# Altium schematic sheet 14_Temp.SchDoc: Power
size A3; Organization: Lime Microsystems; Address1: Surrey Tech Centre; Address2: Guildford GU2 7YG; Address3: Surrey; Address4: United Kingdom; Revision: v1.2; SheetNumber: 13; SheetTotal: 13
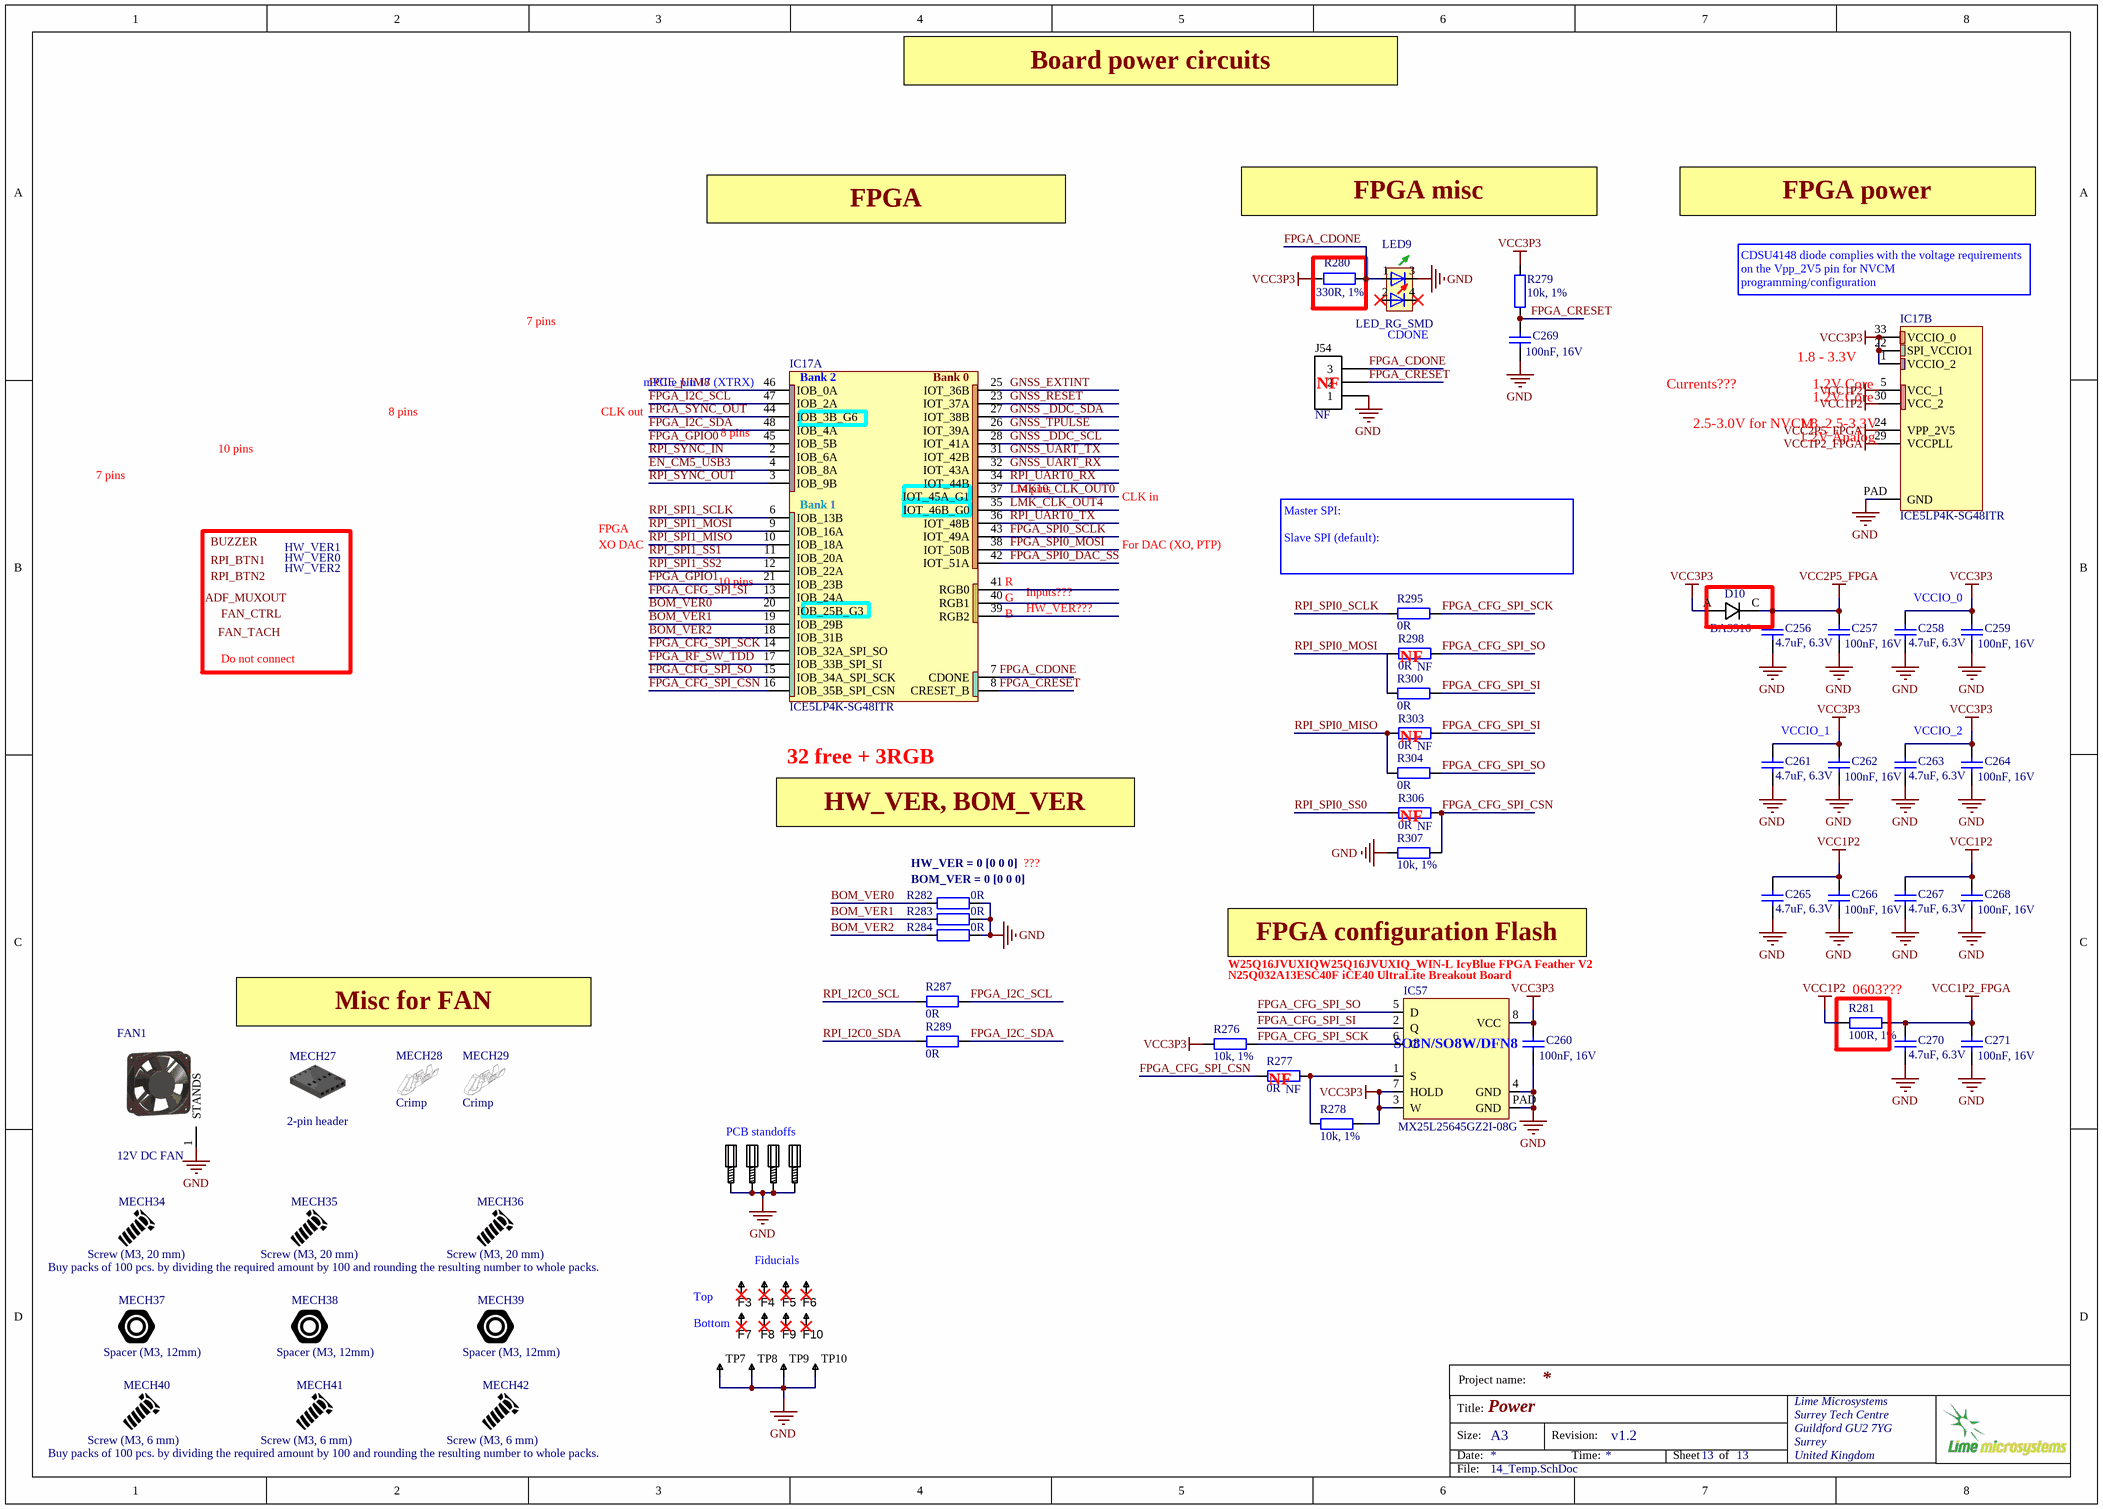
[diagram p0: 14_Temp.SchDoc]

## Parts
C256  4.7uF, 6.3V  [CAP0402]
C257  100nF, 16V  [CAP0402]
C258  4.7uF, 6.3V  [CAP0402]
C259  100nF, 16V  [CAP0402]
C260  100nF, 16V  [CAP0402]
C261  4.7uF, 6.3V  [CAP0402]
C262  100nF, 16V  [CAP0402]
C263  4.7uF, 6.3V  [CAP0402]
C264  100nF, 16V  [CAP0402]
C265  4.7uF, 6.3V  [CAP0402]
C266  100nF, 16V  [CAP0402]
C267  4.7uF, 6.3V  [CAP0402]
C268  100nF, 16V  [CAP0402]
C269  100nF, 16V  [CAP0402]
C270  4.7uF, 6.3V  [CAP0402]
C271  100nF, 16V  [CAP0402]
D10  BAS316  [BAS316_DIODE_SOD323]
F3  Fiducial  [Fiducial]  (value not drawn)
F4  Fiducial  [Fiducial]  (value not drawn)
F5  Fiducial  [Fiducial]  (value not drawn)
F6  Fiducial  [Fiducial]  (value not drawn)
F7  Fiducial  [Fiducial]  (value not drawn)
F8  Fiducial  [Fiducial]  (value not drawn)
F9  Fiducial  [Fiducial]  (value not drawn)
F10  Fiducial  [Fiducial]  (value not drawn)
FAN1  12V DC FAN  [FAN_80mm_V1]
IC17  ICE5LP4K-SG48ITR  [ICE5LP4K-SG48ITR_Lattice_FPGA_QFN48]  (parts A,B of 2)
IC57  MX25L25645GZ2I-08G  [S25FL164K_WSON8_DFN6]
J54  Assembly Info: NF  [HDR_1x3]  (hidden comment: Header 3x1 pin)
LED9  LED_RG_SMD  [LED-2x0603]
MECH27  2-pin header  (mechanical)
MECH28  Crimp  (mechanical)
MECH29  Crimp  (mechanical)
MECH30  # pcs.  [PCB_standoff]  (value not drawn)
MECH31  # pcs.  [PCB_standoff]  (value not drawn)
MECH32  # pcs.  [PCB_standoff]  (value not drawn)
MECH33  # pcs.  [PCB_standoff]  (value not drawn)
MECH34  Screw (M3, 20 mm)  (mechanical)
MECH35  Screw (M3, 20 mm)  Assembly Info: Buy packs of 100 pcs. by dividing the required amount by 100 and rounding the resulting number to whole packs.  (mechanical)
MECH36  Screw (M3, 20 mm)  (mechanical)
MECH37  Spacer (M3, 12mm)  (mechanical)
MECH38  Spacer (M3, 12mm)  (mechanical)
MECH39  Spacer (M3, 12mm)  (mechanical)
MECH40  Screw (M3, 6 mm)  (mechanical)
MECH41  Screw (M3, 6 mm)  Assembly Info: Buy packs of 100 pcs. by dividing the required amount by 100 and rounding the resulting number to whole packs.  (mechanical)
MECH42  Screw (M3, 6 mm)  (mechanical)
R276  10k, 1%  [RES0402]
R277  0R  Assembly Info: NF  [RES0402]
R278  10k, 1%  [RES0402]
R279  10k, 1%  [RES0402]
R280  330R, 1%  [RES0402]
R281  100R, 1%  [RES0603]
R282  0R  [RES0402]
R283  0R  [RES0402]
R284  0R  [RES0402]
R287  0R  [RES0402]
R289  0R  [RES0402]
R295  0R  [RES0402]
R298  0R  Assembly Info: NF  [RES0402]
R300  0R  [RES0402]
R303  0R  Assembly Info: NF  [RES0402]
R304  0R  [RES0402]
R306  0R  Assembly Info: NF  [RES0402]
R307  10k, 1%  [RES0402]
TP7  TESTPOINT_THT_MINI  [TP-SMD-LOW_PROFILE]  (value not drawn)
TP8  TESTPOINT_THT_MINI  [TP-SMD-LOW_PROFILE]  (value not drawn)
TP9  TESTPOINT_THT_MINI  [TP-SMD-LOW_PROFILE]  (value not drawn)
TP10  TESTPOINT_THT_MINI  [TP-SMD-LOW_PROFILE]  (value not drawn)

## Nets
GND: C256.1 C257.2 C258.1 C259.2 C260.2 C261.1 C262.2 C263.1 C264.2 C265.1 C266.2 C267.1 C268.2 C269.2 C270.1 C271.2 FAN1.1(STANDS) IC17.PAD(GND) IC57.4(GND) IC57.PAD(GND) J54.1 LED9.3 MECH30.MH1 MECH31.MH1 MECH32.MH1 MECH33.MH1 R282.2 R283.2 R284.2 R307.1 TP7.1 TP8.1 TP9.1 TP10.1
VCC1P2: C265.2 C266.1 C267.2 C268.1 IC17.5(VCC_1) IC17.30(VCC_2) R281.2
VCC1P2_FPGA: C270.2 C271.1 IC17.29(VCCPLL) R281.1
VCC2P5_FPGA: C256.2 C257.1 D10.C IC17.24(VPP_2V5)
VCC3P3: C258.2 C259.1 C260.1 C261.2 C262.1 C263.2 C264.1 D10.A IC17.1(VCCIO_2) IC17.22(SPI_VCCIO1) IC17.33(VCCIO_0) IC57.3(W) IC57.7(HOLD) IC57.8(VCC) R276.2 R278.2 R279.1 R280.2
BOM_VER0: IC17.20(IOB_25B_G3) R282.1
BOM_VER1: IC17.19(IOB_29B) R283.1
BOM_VER2: IC17.18(IOB_31B) R284.1
EN_CM5_USB3: IC17.4(IOB_8A)
FPGA_CDONE: IC17.7(CDONE) J54.3 LED9.1 R280.1
FPGA_CFG_SPI_CSN: IC17.16(IOB_35B_SPI_CSN) R277.2 R306.1 R307.2
FPGA_CFG_SPI_SCK: IC17.14(IOB_32A_SPI_SO) IC57.6(C) R276.1 R295.2
FPGA_CFG_SPI_SI: IC17.13(IOB_24A) IC57.2(Q) R300.2 R303.1
FPGA_CFG_SPI_SO: IC17.15(IOB_34A_SPI_SCK) IC57.5(D) R298.1 R304.2
FPGA_CRESET: C269.1 IC17.8(CRESET_B) J54.2 R279.2
FPGA_GPIO0: IC17.45(IOB_5B)
FPGA_GPIO1: IC17.21(IOB_23B)
FPGA_I2C_SCL: IC17.47(IOB_2A) R287.2
FPGA_I2C_SDA: IC17.48(IOB_4A) R289.2
FPGA_RF_SW_TDD: IC17.17(IOB_33B_SPI_SI)
FPGA_SPI0_DAC_SS: IC17.42(IOT_51A)
FPGA_SPI0_MOSI: IC17.38(IOT_50B)
FPGA_SPI0_SCLK: IC17.43(IOT_49A)
FPGA_SYNC_OUT: IC17.44(IOB_3B_G6)
GNSS _DDC_SCL: IC17.28(IOT_41A)
GNSS _DDC_SDA: IC17.27(IOT_38B)
GNSS_EXTINT: IC17.25(IOT_36B)
GNSS_RESET: IC17.23(IOT_37A)
GNSS_TPULSE: IC17.26(IOT_39A)
GNSS_UART_RX: IC17.32(IOT_43A)
GNSS_UART_TX: IC17.31(IOT_42B)
LMK10_CLK_OUT0: IC17.37(IOT_45A_G1)
LMK_CLK_OUT4: IC17.35(IOT_46B_G0)
PCIE_UIM8: IC17.46(IOB_0A)
RPI_I2C0_SCL: R287.1
RPI_I2C0_SDA: R289.1
RPI_SPI0_MISO: R303.2 R304.1
RPI_SPI0_MOSI: R298.2 R300.1
RPI_SPI0_SCLK: R295.1
RPI_SPI0_SS0: R306.2
RPI_SPI1_MISO: IC17.10(IOB_18A)
RPI_SPI1_MOSI: IC17.9(IOB_16A)
RPI_SPI1_SCLK: IC17.6(IOB_13B)
RPI_SPI1_SS1: IC17.11(IOB_20A)
RPI_SPI1_SS2: IC17.12(IOB_22A)
RPI_SYNC_IN: IC17.2(IOB_6A)
RPI_SYNC_OUT: IC17.3(IOB_9B)
RPI_UART0_RX: IC17.34(IOT_44B)
RPI_UART0_TX: IC17.36(IOT_48B)
NetIC57_1: IC57.1(S) R277.1 R278.1

Not connected (* = marked no-connect by the designer): F3 1*; F4 1*; F5 1*; F6 1*; F7 1*; F8 1*; F9 1*; F10 1*; IC17 39(RGB2) 40(RGB1) 41(RGB0); LED9 2* 4*

## Notes on the sheet
- Board power circuits
- FPGA
- FPGA misc
- FPGA power
- (near IC17) CDSU4148 diode complies with the voltage requirements on the Vpp_2V5 pin for NVCM programming/configuration
- 7 pins
- (near LED9) CDONE
- (near IC17) 1.8 - 3.3V
- 10 pins
- 8 pins
- CLK out
- mPCIe pin 17 (XTRX)
- (near IC17) 8 pins
- (near J54) NF
- Currents???
- 2.5-3.0V for NVCM
- (near IC17) 1.2V Analog
- (near IC17) 1.8, 2.5-3,3V
- (near IC17) 1.2V Core
- (near IC17) 14 pins
- CLK in
- HW_VER0
- HW_VER1
- HW_VER2
- XO DAC
- (near IC17) 10 pins
- (near IC17) R
- For DAC (XO, PTP)
- (near R295) Master SPI:
  Slave SPI (default):
- (near IC17) G
- (near IC17) B
- (near IC17) Inputs???
- (near IC17) HW_VER???
- VCCIO_0
- Do not connect
- (near R298) NF
- 32 free + 3RGB
- (near R303) NF
- VCCIO_1
- VCCIO_2
- HW_VER, BOM_VER
- (near R306) NF
- (near R282) BOM_VER = 0 [0 0 0]
- HW_VER = 0 [0 0 0]
- ???
- FPGA configuration Flash
- (near IC57) W25Q16JVUXIQW25Q16JVUXIQ_WIN-L IcyBlue FPGA Feather V2
- (near IC57) N25Q032A13ESC40F iCE40 UltraLite Breakout Board
- Misc for FAN
- 0603???
- (near R277) NF
- PCB standoffs
- Top
- (near F7) Bottom
- Fiducials
- Labels drawn without touching a wire or pin: ADF_MUXOUT, BUZZER, FAN_CTRL, FAN_TACH, RPI_BTN1, RPI_BTN2
- Project name:
- Title:
- Size:
- Date:
- A3
- Revision:
- Time:
- Sheet
- of
- File:
- (in symbol ICE5LP4K-SG48ITR_Lattice_FPGA, part A) Bank 2; Bank 0; Bank 1
- (in symbol M25P40_with_pad) SO8N/SO8W/DFN8

## Library data of the parts
C256 C258 C261 C263 C265 C267 C270 = Cap_0402: Manufacturer: Murata Electronics North America; Manufacturer Part Number: GRM155R60J475ME87D; Part Description: 4.7µF ±20% 6.3V X5R Ceramic Capacitor -55°C ~ 85°C Surface Mount, MLCC 0402 (1005 Metric) 0.039" L x 0.020" W (1.00mm x 0.50mm); Tolerance: ±20%; Capacitance: 4.7µF; Temperature Coefficient: X5R; Lead Style: -; Ratings: -; Height - Seated (Max): -; Thickness (Max): 0.022" (0.55mm); Voltage - Rated: 6.3V; Packaging: Cut Tape (CT); Lead Spacing: -; Category: Capacitors; Supplier Part Number 1: 490-5408-1-ND; Applications: General Purpose; Operating Temperature: -55°C ~ 85°C; Mounting Type: Surface Mount, MLCC; Features: Derating Recommended; RoHS: RoHS Compliant; Supplier 1: Digi-Key; Package / Case: 0402 (1005 Metric); Size / Dimension: 0.039" L x 0.020" W (1.00mm x 0.50mm); Value: 4.7uF, 6.3V; Manufacturer Part Number 1: GRM155R60J475ME87D
C257 C259 C260 C262 C264 C266 C268 C269 C271 = Cap_0603: Manufacturer Part Number 1: GRM155R71C104KA88D; Part Description: 0.10µF ±10% 16V Ceramic Capacitor X7R 0402 (1005 Metric); Brand: Murata Electronics; Tolerance: 10 %; Type: General Purpose MLCC; Capacitance: 0.1 uF; Temperature Coefficient / Code: +/- 15 %; Case Height: 0.5 mm; Case Length: 1 mm; Dielectric: X7R; Supplier 1: Mouser; Supplier Part Number 1: 81-GRM155R71C104KA88; Case Code - in: 0402; Manufacturer: Murata Electronics; Category: Multilayer Ceramic Capacitors MLCC - SMD/SMT; Voltage Rating DC: 16 V; Value: 100nF, 16V; Manufacturer Part Number: GRM155R71C104KA88D; Case Code - mm: 1005; Case Width: 0.5 mm; Maximum Operating Temperature: + 125 C; Minimum Operating Temperature: - 55 C; Minimum Order Quantity: 1; Operating Temperature Range: - 55 C to + 125 C; Package / Case: 0402 (1005 metric); Packaging: Reel; Product: General Type MLCCs; Product Category: Low & Medium Capacitance SMD Ceramic Chip Capacitors; Reeling: True; RoHS - Mouser: Y; RoHS: RoHS Compliant; Series: GRM; Standard Pack Qty: 10000; Termination Style: SMD/SMT
D10 = MURA120T3G_diode: Part Description: DIODE GEN PURP 100V 250MA SOD323; Manufacturer: Nexperia; Manufacturer Part Number 1: BAS316,115; ComponentLink1URL: http://www.mouser.com/ds/2/427/mmsz5225-102133.pdf; ComponentLink1Description: http://www.mouser.com/ds/2/427/mmsz5225-102133.pdf; ComponentLink2URL: http://www.onsemi.com/pub/Collateral/MMSD4148T1-D.PDF; ComponentLink2Description: http://www.onsemi.com/pub/Collateral/MMSD4148T1-D.PDF; ComponentLink3URL: http://www.farnell.com/datasheets/1707241.pdf; ComponentLink3Description: http://www.farnell.com/datasheets/1707241.pdf; ComponentLink4URL: https://www.verical.com/server-webapp/html/getDatasheet?partID=78734; ComponentLink4Description: https://www.verical.com/server-webapp/html/getDatasheet?partID=78734; ComponentLink5URL: http://www.onsemi.com/pub/Collateral/MURA115T3-D.PDF; ComponentLink5Description: http://www.onsemi.com/pub/Collateral/MURA115T3-D.PDF; ComponentLink6URL: http://www.jameco.com/Jameco/Products/ProdDS/1100812.pdf; ComponentLink6Description: http://www.jameco.com/Jameco/Products/ProdDS/1100812.pdf; ComponentLink7URL: http://uk.rs-online.com/webdocs/1221/0900766b812212fb.pdf; ComponentLink7Description: http://uk.rs-online.com/webdocs/1221/0900766b812212fb.pdf; ComponentLink8URL: http://www.farnell.com/datasheets/1750742.pdf; ComponentLink8Description: http://www.farnell.com/datasheets/1750742.pdf; Supplier 1: Digi-Key; Supplier Part Number 1: 1727-4309-1-ND; Stock 1: 163548; Pricing 1: 1=0,16000, 10=0,14200, 100=0,07710, 500=0,04744, 1000=0,03234 (USD); RoHS: Yes; RoHS Compliant: Yes; ComponentLink9URL: http://www.farnell.com/datasheets/1856332.pdf?src-supplier=Farnell; ComponentLink9Description: http://www.farnell.com/datasheets/1856332.pdf?src-supplier=Farnell; ComponentLink10URL: https://assets.nexperia.com/documents/data-sheet/BAS16_SER.pdf?src-supplier=Digi-Key; ComponentLink10Description: https://assets.nexperia.com/documents/data-sheet/BAS16_SER.pdf?src-supplier=Digi-Key; ComponentLink11URL: http://www.farnell.com/datasheets/1856332.pdf?src-supplier=Newark; ComponentLink11Description: http://www.farnell.com/datasheets/1856332.pdf?src-supplier=Newark
FAN1 = 12V_DC_FAN: Part Description: Fan Tubeaxial 12VDC Square - 80mm L x 80mm H Vapo-Bearing™ 37.0 CFM (1.04m³/min) 2 Wire Leads; Manufacturer: Sunon; Manufacturer Part Number 1: ME80151V1-000U-A99; Airflow: 37CFM; Noise: 34.7dBA; Max Power Dissipation: 1.96W; RPM: 3000RPM; Bearing Type: Vapo-Bearing; Current Rating: 163mA; Approvals: UL,CE,TUV; Supplier 1: Digi-Key; Supplier Part Number 1: 259-1649-ND; Stock 1: 1611; Pricing 1: 1=6,90000, 10=6,66700, 25=6,47400, 50=6,08860, 100=5,47200, 250=5,39488, 500=5,04808 (USD); RoHS: Yes; Case/Package: Axial; Housing Material: Thermoplastic; Weight: 0.15lb; Min Operating Temperature: 14°C; Max Operating Temperature: 158°C; Termination: 2 Wire Leads; Package Quantity: 30; Width: 15mm; Flammability Rating: UL94 V-0; ComponentLink1URL: https://datasheet.ciiva.com/18514/me8015-u-18514537.pdf?src-supplier=Digi-Key; ComponentLink1Description: https://datasheet.ciiva.com/18514/me8015-u-18514537.pdf?src-supplier=Digi-Key
IC17 = ICE5LP4K-SG48ITR_Lattice_FPGA: Part Description: iCE40 Ultra™ Field Programmable Gate Array (FPGA) IC 39 81920 3520 48-VFQFN Exposed Pad; Manufacturer: Lattice Semiconductor; Supplier 1: Digikey; Supplier Part Number 1: 220-2234-1-ND; Manufacturer Part Number 1: ICE5LP4K-SG48ITR; Stock 1: 1298; Pricing 1: 1=8,8, 25=7,65, 100=7,41 (USD); RoHS: Yes; ComponentLink1URL: https://datasheet.octopart.com/ICE5LP4K-SG48ITR-Lattice-Semiconductor-datasheet-46750633.pdf?src-supplier=Future+Electronics; ComponentLink1Description: https://datasheet.octopart.com/ICE5LP4K-SG48ITR-Lattice-Semiconductor-datasheet-46750633.pdf?src-supplier=Future+Electronics; ComponentLink2URL: http://www.latticesemi.com/~/media/LatticeSemi/Documents/DataSheets/iCE/iCE40UltraFamilyDataSheet.pdf?src-supplier=Digikey; ComponentLink2Description: http://www.latticesemi.com/~/media/LatticeSemi/Documents/DataSheets/iCE/iCE40UltraFamilyDataSheet.pdf?src-supplier=Digikey; ComponentLink3URL: https://datasheet.octopart.com/ICE5LP4K-SG48ITR-Lattice-Semiconductor-datasheet-94675077.pdf?src-supplier=SHENGYU+ELECTRONICS; ComponentLink3Description: https://datasheet.octopart.com/ICE5LP4K-SG48ITR-Lattice-Semiconductor-datasheet-94675077.pdf?src-supplier=SHENGYU+ELECTRONICS
IC57 = M25P40_with_pad: Part Description: FLASH - NOR Memory IC 256Mbit SPI 120 MHz 8-WSON (8x6); Manufacturer: Macronix; Memory Type: Non-Volatile,FLASH; Memory Size: 256Mb; Frequency: 120MHz; ComponentLink1URL: http://www.winbond.com/resource-files/w25q128jv%20revf%2003272018%20plus.pdf?src-supplier=Digi-Key; ComponentLink1Description: http://www.winbond.com/resource-files/w25q128jv%20revf%2003272018%20plus.pdf?src-supplier=Digi-Key; ComponentLink2URL: http://www.macronix.com/Lists/Datasheet/Attachments/7549/MX25L25645G,%203V,%20256Mb,%20v1.7.pdf?src-supplier=Digi-Key; ComponentLink2Description: http://www.macronix.com/Lists/Datasheet/Attachments/7549/MX25L25645G,%203V,%20256Mb,%20v1.7.pdf?src-supplier=Digi-Key; ComponentLink3URL: http://ckassoc.com/oldsite/pdf/Macronix_Product_Line_Card_July_2017_General%20_070617.pdf?src-supplier=Digi-Key; ComponentLink3Description: http://ckassoc.com/oldsite/pdf/Macronix_Product_Line_Card_July_2017_General%20_070617.pdf?src-supplier=Digi-Key; Value: MX25L25645GZ2I-08G; Supplier 1: Digi-Key; Supplier Part Number 1: 1092-1237-ND; Manufacturer Part Number 1: MX25L25645GZ2I-08G; Stock 1: 23084; Pricing 1: 1=4,06000, 10=3,68400, 25=3,60360, 40=3,58400, 80=3,21363, 230=3,20191, 480=3,08490, 960=2,93280 (USD); RoHS: Yes; Mount: Surface Mount; Case/Package: SOIC; Min Operating Temperature: -40°C; Max Operating Temperature: 85°C; RoHS Compliant: Yes; ComponentLink4URL: http://www.macronix.com/Lists/Datasheet/Attachments/7444/MX25L25673G,%203V,%20256Mb,%20v1.4.pdf?src-supplier=Digi-Key; ComponentLink4Description: http://www.macronix.com/Lists/Datasheet/Attachments/7444/MX25L25673G,%203V,%20256Mb,%20v1.4.pdf?src-supplier=Digi-Key
J54 = Header3P: Header, 3-pin; Manufacturer 1: Wurth Electronics; Manufacturer Part Number: 61300311121; Part Description: Connector Header Through Hole 3 position 0.100" (2.54mm); Number of Positions: 3; Gender: Male; Connector Type: Male Pin; Pitch: 0.1inch; Supplier 1: Digi-Key; Supplier Part Number 1: 732-5316-ND; Stock 1: 95926; Pricing 1: 1=0,13000, 10=0,11300, 25=0,09400, 50=0,07900, 100=0,07100, 1000=0,06600 (USD); RoHS: Yes; Mount: Through Hole; Contact Plating: Gold; Contact Material: Copper; Color: Black; Number of Rows: 1; Packaging: Bulk; Termination: Solder; Number of Contacts: 3; Contact Mating Length: 0.236inch; REACH SVHC: Unknown; Lead Free: Lead Free; RoHS Compliant: Yes; ComponentLink1URL: http://www.farnell.com/cad/1737268.pdf?src-supplier=Element14; ComponentLink1Description: http://www.farnell.com/cad/1737268.pdf?src-supplier=Element14; ComponentLink2URL: https://katalog.we-online.de/em/datasheet/6130xx11121.pdf?src-supplier=Digi-Key; ComponentLink2Description: https://katalog.we-online.de/em/datasheet/6130xx11121.pdf?src-supplier=Digi-Key; Manufacturer: Wurth Electronics; Manufacturer Part Number 1: 61300311121
LED9 = LED_green_red_SMD: Manufacturer Part Number 1: HSMF-C165; Manufacturer: Avago Technologies US Inc.; Part Description: LED GREEN/RED DIFFUSED 0603 SMD; Millicandela Rating: 15mcd Green, 10mcd Red; Lens Transparency: Diffused; Lens Color: White; Lens Style/Size: Rectangle with Flat Top, 1.60mm x 0.80mm; Wavelength - Peak: 570nm Green, 636nm Red; Wavelength - Dominant: 572nm Green, 621nm Red; Viewing Angle: 120°; Voltage - Forward (Vf) (Typ): 2.2V Green, 1.95V Red; Current - Test: 20mA; Color: Green, Red; Supplier 1: Digi-Key; Height (Max): 0.50mm; Packaging: Cut Tape (CT); Category: Optoelectronics; Mounting Type: Surface Mount; Package / Case: 0603 (1608 Metric); Size / Dimension: 1.60mm L x 0.80mm W; Supplier Device Package: *; RoHS: RoHS Compliant; Supplier Part Number 1: 516-1419-1-ND
MECH27 = Universal_crimped_header: Part Description: 2 Rectangular Connectors - Housings Receptacle White 0.100" (2.54mm); Manufacturer: Molex; Gender: Female; Voltage Rating: 250V; Number of Contacts: 2; Connector Type: Receptacle; Max Current Rating: 4A; Pitch: 2.54mm; Glow Wire Compliant: Non-compliant; Approvals: UL,CSA; Supplier 1: Newark; Supplier Part Number 1: 47T5763; Manufacturer Part Number 1: 22-01-2027; Stock 1: 50789; Pricing 1: 1=0,12200, 10=0,09500, 25=0,08600, 50=0,07700, 100=0,06700, 250=0,06400 (USD); RoHS: Yes; Mount: Free Hanging,Cable; Contact Material: Bronze,Brass; Color: White; Housing Color: White; Housing Material: Nylon; Min Operating Temperature: 0°C; Max Operating Temperature: 75°C; Number of Rows: 1; Package Quantity: 5000; Packaging: Bag; Termination: Crimp; Number of Circuits: 2; Number of Positions: 2; Orientation: Straight; Series: KK® 2695; Contact Type: Non-Gendered; Contact Gender: Female; Fastening Type: Ramp; Length: 5.64mm; Width: 4.82mm; Height: 4.82mm; Depth: 12.7mm; Lead Pitch: 2.54mm; Radiation Hardening: No; Halogen Free: Low Halogen; Flammability Rating: UL94 V-0; RoHS Compliant: Yes; Lead Free: Lead Free
MECH28 MECH29 = Universal_crimp: Part Description: Non-Gendered Contact Tin 22-30 AWG Crimp; Manufacturer: Molex; Body Plating: Tin; Current Rating: 4A; Voltage Rating: 250V; Gender: Female; Connector Type: PCB; Number of Contacts: 1; Contact Resistance: 20mR; Max Current Rating: 2.5A; Resistance: 0.02R; Insulation Resistance: 500GR; Shielding: Unshielded; Wire Gauge (Max): 22AWG; Wire Gauge (Min): 30AWG; Wire/Cable Diameter: 1.57mm; Approvals: UL,CSA; Supplier 1: Mouser; Supplier Part Number 1: 538-08-50-0032; Manufacturer Part Number 1: 08-50-0032; Stock 1: 153072; Pricing 1: 1=0,12000, 10=0,08100, 50=0,08000, 100=0,08000, 1000=0,06400, 10000=0,06400 (USD); RoHS: Yes; Mount: Cable; Contact Material: Brass; Housing Material: Nylon; Terminal Material: Brass; Contact Plating: Tin,Brass; Min Operating Temperature: 0°C; Max Operating Temperature: 75°C; Contact Gender: Female; Packaging: Bulk; Termination: Crimp; Orientation: Straight; Series: KK® 4809; Contact Type: Signal; Voltage Rating (AC): 250V; Package Quantity: 80000; Max Voltage Rating (AC): 250V; Length: 10.4mm; Depth: 2.1mm; Wire/Cable Gauge: 30AWG; Radiation Hardening: No; RoHS Compliant: Yes; Reach SVHC Compliant: Yes; ComponentLink1URL: https://datasheet.ciiva.com/15217/getdatasheetpartid-168593-15217171.pdf?src-supplier=Verical; ComponentLink1Description: https://datasheet.ciiva.com/15217/getdatasheetpartid-168593-15217171.pdf?src-supplier=Verical; ComponentLink2URL: https://datasheet.ciiva.com/19462/736464-19462410.pdf?src-supplier=Jameco; ComponentLink2Description: https://datasheet.ciiva.com/19462/736464-19462410.pdf?src-supplier=Jameco; ComponentLink3URL: https://datasheet.ciiva.com/11723/0900766b80027326-11723308.pdf?src-supplier=Rs; ComponentLink3Description: https://datasheet.ciiva.com/11723/0900766b80027326-11723308.pdf?src-supplier=Rs
MECH30-MECH33 = STANDOFF_M-F_THREADED_M3x8x10mm_HEX_5mm dia: STANDOFF M/F MET 5MM HEX 10MM L; Manufacturer: FIX&FASTEN; Manufacturer Part Number 1: FIX-MAE-5TV; Part Description: PCB distance; polyamide; L:5mm; Colour: natural; Øcutout:3mm; Unit: pcs; SuppliedAmount: 1000; MinAmount: 10; Type of spacer: PCB distance; Panel cutout diameter: 3mm; Spanner size: 5.5mm; Internal thread: M3; Thread pitch: 0,5; Supplier 1: TME; Supplier Part Number 1: FIX-MAE-5TV; Category: Plastic Pegs; Weight: 0.145; Multiples: 10; Material: polyamide; Spacer length: 5mm; Price Type: NET
MECH34 MECH36 = Universal_mech_screw: Part Description: Machine Screw, M3, 20 mm, Steel, Bright Zinc, Flat / Countersunk Head Pozidriv, Pack of 100; Manufacturer: TR Fastenings; Manufacturer Part Number 1: M3 20 KRSTMC Z100; Assembly Info: Buy packs of 100 pcs. by dividing the required amount by 100 and rounding the resulting number to whole packs.; Supplier 1: Farnell; Supplier Part Number 1: 1420401; Stock 1: 226; Pricing 1: 1=2,66000, 30=1,88000, 60=1,77000 (EUR); RoHS: No; ComponentLink1URL: http://www.farnell.com/datasheets/2644719.pdf?src-supplier=Farnell; ComponentLink1Description: http://www.farnell.com/datasheets/2644719.pdf?src-supplier=Farnell
MECH35 = Universal_mech_screw: Part Description: Machine Screw, M3, 20 mm, Steel, Bright Zinc, Flat / Countersunk Head Pozidriv, Pack of 100; Manufacturer: TR Fastenings; Manufacturer Part Number 1: M3 20 KRSTMC Z100; Supplier 1: Farnell; Supplier Part Number 1: 1420401; Stock 1: 226; Pricing 1: 1=2,66000, 30=1,88000, 60=1,77000 (EUR); RoHS: No; ComponentLink1URL: http://www.farnell.com/datasheets/2644719.pdf?src-supplier=Farnell; ComponentLink1Description: http://www.farnell.com/datasheets/2644719.pdf?src-supplier=Farnell
MECH37-MECH39 = Universal_mech_nut: Part Description: Standoff, Brass, M3, Hex Female, 12 mm, 12 mm; Manufacturer: ETTINGER; Manufacturer Part Number 1: 005.03.123; Supplier 1: Farnell; Supplier Part Number 1: 1466772
MECH40 MECH42 = Universal_mech_screw: Part Description: Machine Screw, M3, 6 mm, Steel 4.8, Bright Zinc, Pan Head Pozidriv; Manufacturer: TR Fastenings; Manufacturer Part Number 1: M3 6 PRSTMC Z100; Assembly Info: Buy packs of 100 pcs. by dividing the required amount by 100 and rounding the resulting number to whole packs.; Supplier 1: Farnell; Supplier Part Number 1: 1419986; Stock 1: 2173; Pricing 1: 1=1,90000, 25=1,35000, 50=1,23000 (EUR); RoHS: No; ComponentLink1URL: http://www.farnell.com/datasheets/2644718.pdf?src-supplier=Farnell; ComponentLink1Description: http://www.farnell.com/datasheets/2644718.pdf?src-supplier=Farnell
MECH41 = Universal_mech_screw: Part Description: Machine Screw, M3, 6 mm, Steel 4.8, Bright Zinc, Pan Head Pozidriv; Manufacturer: TR Fastenings; Manufacturer Part Number 1: M3 6 PRSTMC Z100; Supplier 1: Farnell; Supplier Part Number 1: 1419986; Stock 1: 2173; Pricing 1: 1=1,90000, 25=1,35000, 50=1,23000 (EUR); RoHS: No; ComponentLink1URL: http://www.farnell.com/datasheets/2644718.pdf?src-supplier=Farnell; ComponentLink1Description: http://www.farnell.com/datasheets/2644718.pdf?src-supplier=Farnell
R276 R278 R279 R307 = Res_0402: Manufacturer: Yageo; Manufacturer Part Number 1: RC0402FR-0710KL; Part Description: RES SMD 10K OHM 1% 1/16W 0402; Temperature Coefficient: ±100ppm/°C; Power (Watts): 0.063W, 1/16W; Value: 10k, 1%; Supplier 1: Digi-Key; Supplier Part Number 1: 311-10.0KLRTR-ND; Resistance (Ohms): 10k; Packaging: Tape & Reel (TR); RoHS: RoHS Compliant; Package / Case: 0402 (1005 Metric); Tolerance: ±1%; Operating Temperature: -55°C ~ 155°C; Size / Dimension: 0.039" L x 0.020" W (1.00mm x 0.50mm); Number of Terminations: 2; Category: Resistors; Height: 0.016" (0.40mm); Supplier Device Package: 0402; Features: Moisture Resistant; Composition: Thick Film
R277 R287 R289 R295 R298 R300 R303 R304 R306 = Res_0402: Manufacturer Part Number 1: RC0402JR-070RL; Manufacturer: Yageo; Part Description: RES SMD 0.0OHM JUMPER 1/16W 0402; Resistance (Ohms): 0.0; Tolerance: Jumper; Power (Watts): 0.063W, 1/16W; Value: 0R; Supplier 1: Digi-Key; Supplier Part Number 1: 311-0.0JRTR-ND; Category: Resistors; Temperature Coefficient: -; Features: Moisture Resistant; Supplier Device Package: 0402; Height: 0.016" (0.40mm); Package / Case: 0402 (1005 Metric); Operating Temperature: -55°C ~ 155°C; Size / Dimension: 0.039" L x 0.020" W (1.00mm x 0.50mm); Composition: Thick Film; Packaging: Tape & Reel (TR); Number of Terminations: 2; RoHS: RoHS Compliant
R280 = Res_0402: Manufacturer: Yageo; Manufacturer Part Number 1: RC0402FR-07330RL; Part Description: 330 Ohms ±1% 0.063W, 1/16W Chip Resistor 0402 (1005 Metric) Moisture Resistant Thick Film; Max Power Dissipation: 63mW; Power Rating: 62.5mW; Temperature Coefficient: 100ppm/°C; Voltage Rating: 50V; Case/Package: 0402; Case Code (Imperial): 0402; Case Code (Metric): 1005; ComponentLink1Description: http://www.farnell.com/datasheets/2167052.pdf?src-supplier=Farnell; ComponentLink1URL: http://www.farnell.com/datasheets/2167052.pdf?src-supplier=Farnell; ComponentLink2Description: http://www.farnell.com/datasheets/2167052.pdf?src-supplier=Newark; ComponentLink2URL: http://www.farnell.com/datasheets/2167052.pdf?src-supplier=Newark; ComponentLink3Description: http://www.farnell.com/datasheets/1018594.pdf?src-supplier=Element14; ComponentLink3URL: http://www.farnell.com/datasheets/1018594.pdf?src-supplier=Element14; Construction: Rectangular; Depth: 0.5mm; Features: Moisture Resistant; Height: 0.016inch; Lead Free: Lead Free; Length: 0.039inch; Max Operating Temperature: 155°C; Military Standard: Not; Min Operating Temperature: -55°C; Number of Terminations: 2; Package Quantity: 1; Packaging: Tape and Reel; Pricing 1: 1=0,10000, 10=0,01500, 100=0,00610, 1000=0,00275, 2500=0,00239, 5000=0,00197 (USD); REACH SVHC: Unknown; Resistance: 330R; Resistance Tolerance: 1%; Resistor Type: Thick Film; RoHS: Yes; RoHS Compliant: Yes; Series: RC; Size Code: 0402; Stock 1: 7298585; Supplier 1: Digi-Key; Supplier Part Number 1: 311-330LRCT-ND; Technology: THICK FILM; Termination: SMD/SMT; Tolerance: 1%; Value: 330R, 1%; Width: 0.02inch
R281 = Res_0402: Manufacturer Part Number 1: RMCF0402FT100R; Manufacturer: Stackpole Electronics Inc.; Part Description: RES SMD 100 OHM 1% 1/16W 0402; Power (Watts): 0.063W, 1/16W; Temperature Coefficient: ±100ppm/°C; Resistance (Ohms): 100; Value: 100R, 1%; Supplier 1: Digi-Key; Supplier Part Number 1: RMCF0402FT100RDKR-ND; Packaging: Digi-Reel®; Composition: Thick Film; Number of Terminations: 2; Package / Case: 0402 (1005 Metric); RoHS: RoHS Compliant; Category: Resistors; Size / Dimension: 0.039" L x 0.020" W (1.00mm x 0.50mm); Tolerance: ±1%; Supplier Device Package: 0402; Features: -; Height: 0.016" (0.40mm); Operating Temperature: -55°C ~ 155°C
R282-R284 = Res_0402: Manufacturer: Yageo; Part Description: RES SMD 0.0OHM JUMPER 1/16W 0402; Manufacturer Part Number 1: RC0402JR-070RL; Supplier 1: Digi-Key; Supplier Part Number 1: 311-0.0JRTR-ND; Composition: Thick Film; Package / Case: 0402 (1005 Metric); Category: Resistors; Value: 0R
TP7-TP10 = TESTPOINT_THT_MINI: Test Point PCB mount Miniature White; Manufacturer Part Number 1: S1751-46R; Manufacturer: Harwin Inc; Part Description: Natural PC Test Point 0.128" x 0.065" x 0.079" (3.25mm x 1.65mm x 2.00mm) Brass, Tin Plating Surface Mount Mounting Type; Supplier 1: Digi-Key; Supplier Part Number 1: 952-1478-2-ND; RoHS: RoHS Compliant; Color: Natural; Material: Copper Alloy; Mounting Type: Surface Mount; Terminal: 0.128" x 0.065" x 0.079" (3.25mm x 1.65mm x 2.00mm) Brass, Tin Plated; Type: PC Test Point; Packaging: Tape & Reel (TR); Category: Test and Measurement